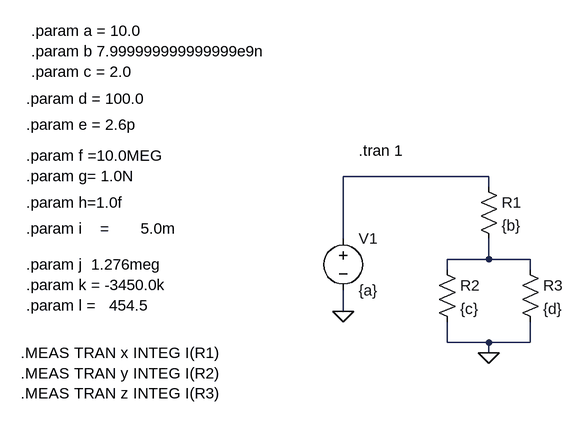
[diagram p0: schematic test3.asc]
test3.asc, the LTspice schematic file:
Version 4
SHEET 1 880 680
WIRE 288 48 64 48
WIRE 288 64 288 48
WIRE 64 144 64 48
WIRE 288 176 288 144
WIRE 288 176 224 176
WIRE 352 176 288 176
WIRE 224 192 224 176
WIRE 352 192 352 176
WIRE 64 256 64 224
WIRE 224 304 224 272
WIRE 288 304 224 304
WIRE 352 304 352 272
WIRE 352 304 288 304
WIRE 288 320 288 304
FLAG 288 320 0
FLAG 64 256 0
SYMBOL voltage 64 128 R0
SYMATTR InstName V1
SYMATTR Value {a}
SYMBOL res 272 48 R0
SYMATTR InstName R1
SYMATTR Value {b}
SYMBOL res 208 176 R0
SYMATTR InstName R2
SYMATTR Value {c}
SYMBOL res 336 176 R0
SYMATTR InstName R3
SYMATTR Value {d}
TEXT -416 -176 Left 2 !.param a = 10.0\n.param b 7.999999999999999e9n\n.param c = 2.0
TEXT 88 8 Left 2 !.tran 1
TEXT -432 320 Left 2 !.MEAS TRAN x INTEG I(R1)\n.MEAS TRAN y INTEG I(R2)\n.MEAS TRAN z INTEG I(R3)
TEXT -424 -72 Left 2 !.param d = 100.0
TEXT -424 -32 Left 2 !.param e = 2.6p
TEXT -424 16 Left 2 !.param f =10.0MEG\n.param g= 1.0N
TEXT -424 88 Left 2 !.param h=1.0f
TEXT -424 128 Left 2 !.param i    =       5.0m
TEXT -424 184 Left 2 !.param j  1.276meg\n.param k = -3450.0k\n.param l =   454.5

The netlist it stands for:
* test3.asc
V1 N001 0 {a}
R1 N001 N002 {b}
R2 N002 0 {c}
R3 N002 0 {d}
.param a = 10.0
.param b 7.999999999999999e9n
.param c = 2.0
.tran 1
.MEAS TRAN x INTEG I(R1)
.MEAS TRAN y INTEG I(R2)
.MEAS TRAN z INTEG I(R3)
.param d = 100.0
.param e = 2.6p
.param f =10.0MEG
.param g= 1.0N
.param h=1.0f
.param i    =       5.0m
.param j  1.276meg
.param k = -3450.0k
.param l =   454.5
.backanno
.end